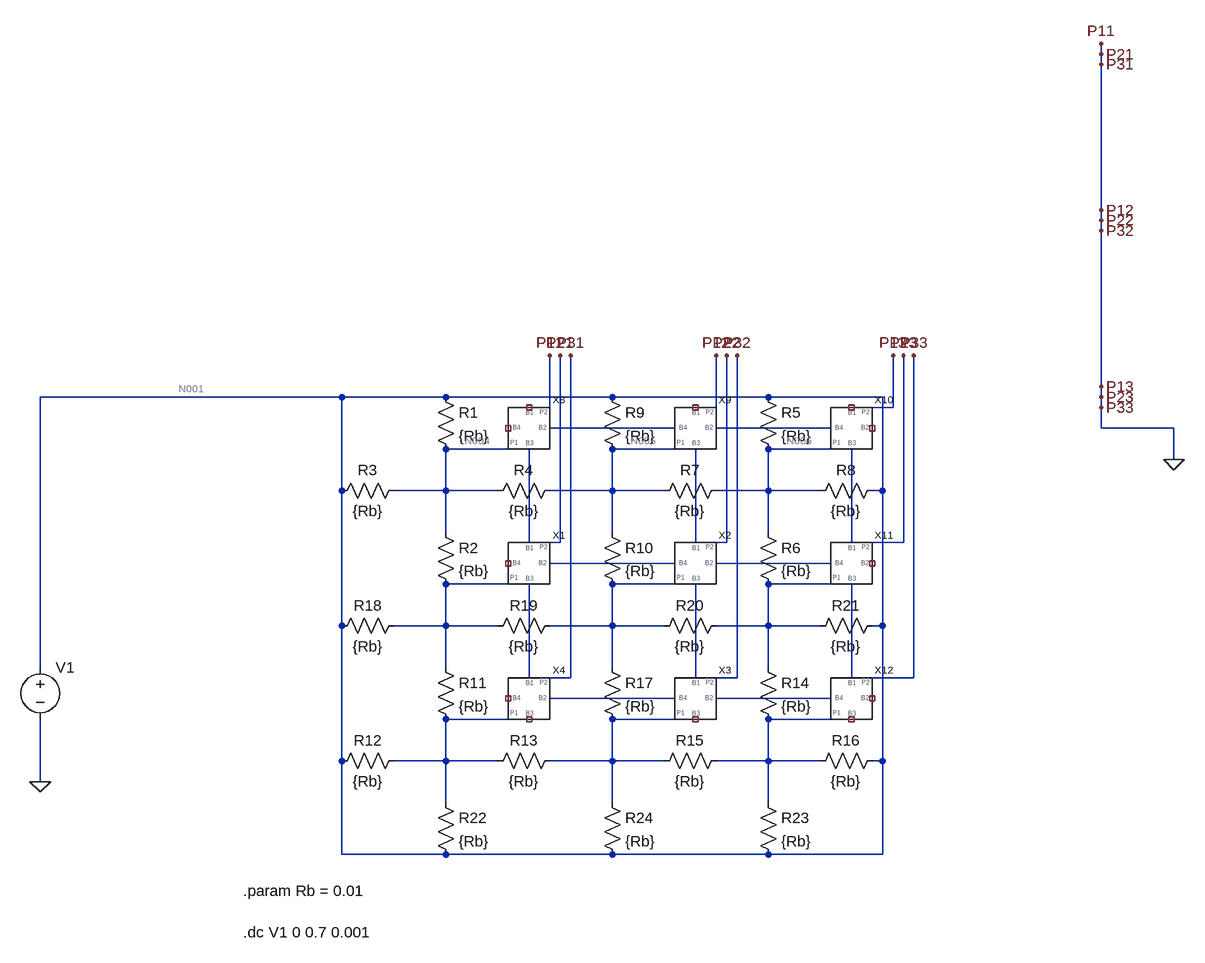
[diagram p0: schematic PV_Model.asc]
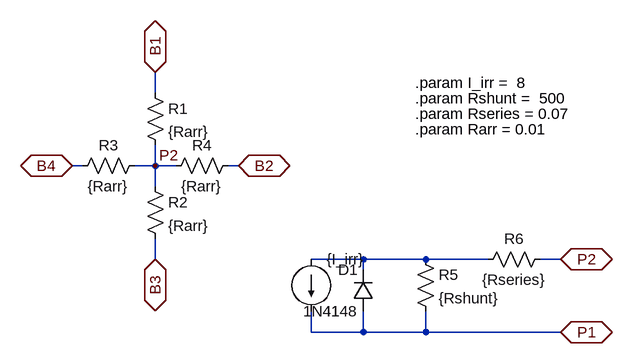
[diagram p1: sub-circuit pv_motif.asc]
PV_Model.asc, the LTspice schematic file:
Version 4
SHEET 1 1476 920
WIRE 1344 -448 1344 -464
WIRE 1344 -432 1344 -448
WIRE 1344 -208 1344 -432
WIRE 1344 -192 1344 -208
WIRE 1344 -176 1344 -192
WIRE 1344 64 1344 -176
WIRE 176 80 -288 80
WIRE 336 80 176 80
WIRE 592 80 336 80
WIRE 832 80 592 80
WIRE 1008 80 832 80
WIRE 1344 80 1344 64
WIRE 496 96 496 16
WIRE 752 96 752 16
WIRE 1024 96 1024 16
WIRE 1024 96 992 96
WIRE 1344 96 1344 80
WIRE 688 128 496 128
WIRE 928 128 752 128
WIRE 1344 128 1344 96
WIRE 1456 128 1344 128
WIRE 432 160 336 160
WIRE 688 160 592 160
WIRE 928 160 832 160
WIRE 1456 176 1456 128
WIRE 176 224 176 80
WIRE 336 224 336 160
WIRE 336 224 256 224
WIRE 416 224 336 224
WIRE 592 224 592 160
WIRE 592 224 496 224
WIRE 672 224 592 224
WIRE 832 224 832 160
WIRE 832 224 752 224
WIRE 912 224 832 224
WIRE 1008 224 1008 80
WIRE 1008 224 992 224
WIRE 336 288 336 224
WIRE 592 288 592 224
WIRE 832 288 832 224
WIRE 464 304 464 160
WIRE 512 304 512 16
WIRE 512 304 496 304
WIRE 720 304 720 160
WIRE 768 304 768 16
WIRE 768 304 752 304
WIRE 960 304 960 160
WIRE 1040 304 1040 16
WIRE 1040 304 992 304
WIRE 688 336 496 336
WIRE 928 336 752 336
WIRE 432 368 336 368
WIRE 688 368 592 368
WIRE 928 368 832 368
WIRE 176 432 176 224
WIRE 336 432 336 368
WIRE 336 432 256 432
WIRE 416 432 336 432
WIRE 592 432 592 368
WIRE 592 432 496 432
WIRE 672 432 592 432
WIRE 832 432 832 368
WIRE 832 432 752 432
WIRE 912 432 832 432
WIRE 1008 432 1008 224
WIRE 1008 432 992 432
WIRE -288 496 -288 80
WIRE 336 496 336 432
WIRE 592 496 592 432
WIRE 832 496 832 432
WIRE 464 512 464 368
WIRE 528 512 528 16
WIRE 528 512 496 512
WIRE 720 512 720 368
WIRE 784 512 784 16
WIRE 784 512 752 512
WIRE 960 512 960 368
WIRE 1056 512 1056 16
WIRE 1056 512 992 512
WIRE 688 544 496 544
WIRE 928 544 752 544
WIRE 432 576 336 576
WIRE 688 576 592 576
WIRE 928 576 832 576
WIRE 176 640 176 432
WIRE 336 640 336 576
WIRE 336 640 256 640
WIRE 416 640 336 640
WIRE 592 640 592 576
WIRE 592 640 496 640
WIRE 672 640 592 640
WIRE 832 640 832 576
WIRE 832 640 752 640
WIRE 912 640 832 640
WIRE 1008 640 1008 432
WIRE 1008 640 992 640
WIRE -288 672 -288 576
WIRE 336 704 336 640
WIRE 592 704 592 640
WIRE 832 704 832 640
WIRE 176 784 176 640
WIRE 336 784 176 784
WIRE 592 784 336 784
WIRE 832 784 592 784
WIRE 1008 784 1008 640
WIRE 1008 784 832 784
FLAG -288 672 0
FLAG 496 16 P11
FLAG 512 16 P21
FLAG 528 16 P31
FLAG 752 16 P12
FLAG 768 16 P22
FLAG 784 16 P32
FLAG 1024 16 P13
FLAG 1040 16 P23
FLAG 1056 16 P33
FLAG 1344 -464 P11
FLAG 1344 -448 P21
FLAG 1344 -432 P31
FLAG 1344 -208 P12
FLAG 1344 -192 P22
FLAG 1344 -176 P32
FLAG 1344 64 P13
FLAG 1344 80 P23
FLAG 1344 96 P33
FLAG 1456 176 0
SYMBOL res 320 64 R0
SYMATTR InstName R1
SYMATTR Value {Rb}
SYMBOL res 320 272 R0
SYMATTR InstName R2
SYMATTR Value {Rb}
SYMBOL res 272 208 R90
WINDOW 0 0 56 VBottom 2
WINDOW 3 32 56 VTop 2
SYMATTR InstName R3
SYMATTR Value {Rb}
SYMBOL res 816 64 R0
SYMATTR InstName R5
SYMATTR Value {Rb}
SYMBOL res 816 272 R0
SYMATTR InstName R6
SYMATTR Value {Rb}
SYMBOL res 768 208 R90
WINDOW 0 0 56 VBottom 2
WINDOW 3 32 56 VTop 2
SYMATTR InstName R7
SYMATTR Value {Rb}
SYMBOL res 1008 208 R90
WINDOW 0 0 56 VBottom 2
WINDOW 3 32 56 VTop 2
SYMATTR InstName R8
SYMATTR Value {Rb}
SYMBOL res 576 64 R0
SYMATTR InstName R9
SYMATTR Value {Rb}
SYMBOL res 576 272 R0
SYMATTR InstName R10
SYMATTR Value {Rb}
SYMBOL res 320 480 R0
SYMATTR InstName R11
SYMATTR Value {Rb}
SYMBOL res 272 624 R90
WINDOW 0 0 56 VBottom 2
WINDOW 3 32 56 VTop 2
SYMATTR InstName R12
SYMATTR Value {Rb}
SYMBOL res 512 624 R90
WINDOW 0 0 56 VBottom 2
WINDOW 3 32 56 VTop 2
SYMATTR InstName R13
SYMATTR Value {Rb}
SYMBOL res 816 480 R0
SYMATTR InstName R14
SYMATTR Value {Rb}
SYMBOL res 768 624 R90
WINDOW 0 0 56 VBottom 2
WINDOW 3 32 56 VTop 2
SYMATTR InstName R15
SYMATTR Value {Rb}
SYMBOL res 1008 624 R90
WINDOW 0 0 56 VBottom 2
WINDOW 3 32 56 VTop 2
SYMATTR InstName R16
SYMATTR Value {Rb}
SYMBOL res 576 480 R0
SYMATTR InstName R17
SYMATTR Value {Rb}
SYMBOL res 272 416 R90
WINDOW 0 0 56 VBottom 2
WINDOW 3 32 56 VTop 2
SYMATTR InstName R18
SYMATTR Value {Rb}
SYMBOL res 512 416 R90
WINDOW 0 0 56 VBottom 2
WINDOW 3 32 56 VTop 2
SYMATTR InstName R19
SYMATTR Value {Rb}
SYMBOL res 768 416 R90
WINDOW 0 0 56 VBottom 2
WINDOW 3 32 56 VTop 2
SYMATTR InstName R20
SYMATTR Value {Rb}
SYMBOL res 1008 416 R90
WINDOW 0 0 56 VBottom 2
WINDOW 3 32 56 VTop 2
SYMATTR InstName R21
SYMATTR Value {Rb}
SYMBOL res 320 688 R0
SYMATTR InstName R22
SYMATTR Value {Rb}
SYMBOL res 816 688 R0
SYMATTR InstName R23
SYMATTR Value {Rb}
SYMBOL res 576 688 R0
SYMATTR InstName R24
SYMATTR Value {Rb}
SYMBOL PV_Motif 464 336 R0
SYMATTR InstName X1
SYMBOL PV_Motif 720 336 R0
SYMATTR InstName X2
SYMBOL PV_Motif 720 544 R0
SYMATTR InstName X3
SYMBOL PV_Motif 464 544 R0
SYMATTR InstName X4
SYMBOL PV_Motif 464 128 R0
SYMATTR InstName X8
SYMBOL PV_Motif 720 128 R0
SYMATTR InstName X9
SYMBOL PV_Motif 960 128 R0
SYMATTR InstName X10
SYMBOL PV_Motif 960 336 R0
SYMATTR InstName X11
SYMBOL PV_Motif 960 544 R0
SYMATTR InstName X12
SYMBOL res 400 240 R270
WINDOW 0 32 56 VTop 2
WINDOW 3 0 56 VBottom 2
SYMATTR InstName R4
SYMATTR Value {Rb}
SYMBOL voltage -288 480 R0
WINDOW 123 0 0 Left 0
WINDOW 39 0 0 Left 0
SYMATTR InstName V1
SYMATTR Value ""
TEXT 24 904 Left 2 !.dc V1 0 0.7 0.001
TEXT 24 840 Left 2 !.param Rb = 0.01

pv_motif.asc, the sub-circuit schematic file:
Version 4
SHEET 1 2152 2064
WIRE -1936 400 -1936 368
WIRE -2048 512 -2064 512
WIRE -1936 512 -1936 480
WIRE -1936 512 -1968 512
WIRE -1904 512 -1936 512
WIRE -1808 512 -1824 512
WIRE -1936 544 -1936 512
WIRE -1936 656 -1936 624
WIRE -1616 656 -1696 656
WIRE -1520 656 -1616 656
WIRE -1424 656 -1520 656
WIRE -1312 656 -1344 656
WIRE -1616 672 -1616 656
WIRE -1696 768 -1696 736
WIRE -1616 768 -1616 736
WIRE -1616 768 -1696 768
WIRE -1520 768 -1520 736
WIRE -1520 768 -1616 768
WIRE -1312 768 -1520 768
FLAG -1936 368 B1
IOPIN -1936 368 BiDir
FLAG -1808 512 B2
IOPIN -1808 512 BiDir
FLAG -1936 656 B3
IOPIN -1936 656 BiDir
FLAG -2064 512 B4
IOPIN -2064 512 BiDir
FLAG -1312 768 P1
IOPIN -1312 768 BiDir
FLAG -1936 512 P2
FLAG -1312 656 P2
IOPIN -1312 656 BiDir
SYMBOL res -1952 384 R0
SYMATTR InstName R1
SYMATTR Value {Rarr}
SYMBOL res -1952 528 R0
SYMATTR InstName R2
SYMATTR Value {Rarr}
SYMBOL res -1952 496 R90
WINDOW 0 0 56 VBottom 2
WINDOW 3 32 56 VTop 2
SYMATTR InstName R3
SYMATTR Value {Rarr}
SYMBOL res -1808 496 R90
WINDOW 0 0 56 VBottom 2
WINDOW 3 32 56 VTop 2
SYMATTR InstName R4
SYMATTR Value {Rarr}
SYMBOL diode -1600 736 R180
WINDOW 0 24 64 Left 2
WINDOW 3 24 0 Left 2
SYMATTR InstName D1
SYMATTR Value 1N4148
SYMBOL current -1696 656 R0
WINDOW 0 24 80 Left 2
WINDOW 3 24 0 Left 2
WINDOW 123 0 0 Left 0
WINDOW 39 0 0 Left 0
SYMATTR InstName I1
SYMATTR Value {I_irr}
SYMBOL res -1536 640 R0
SYMATTR InstName R5
SYMATTR Value {Rshunt}
SYMBOL res -1328 640 R90
WINDOW 0 0 56 VBottom 2
WINDOW 3 32 56 VTop 2
SYMATTR InstName R6
SYMATTR Value {Rseries}
TEXT -1536 384 Left 2 !.param I_irr =  8
TEXT -1536 408 Left 2 !.param Rshunt =  500
TEXT -1536 432 Left 2 !.param Rseries = 0.07
TEXT -1536 456 Left 2 !.param Rarr = 0.01

The netlist it stands for:
* PV_Model.asc
R1 N001 N004 {Rb}
R2 N004 N012 {Rb}
R3 N004 N001 {Rb}
R5 N001 N006 {Rb}
R6 N006 N014 {Rb}
R7 N006 N005 {Rb}
R8 N001 N006 {Rb}
R9 N001 N005 {Rb}
R10 N005 N013 {Rb}
R11 N012 N020 {Rb}
R12 N020 N001 {Rb}
R13 N021 N020 {Rb}
R14 N014 N022 {Rb}
R15 N022 N021 {Rb}
R16 N001 N022 {Rb}
R17 N013 N021 {Rb}
R18 N012 N001 {Rb}
R19 N013 N012 {Rb}
R20 N014 N013 {Rb}
R21 N001 N014 {Rb}
R22 N020 N001 {Rb}
R23 N022 N001 {Rb}
R24 N021 N001 {Rb}
XX1 N007 N010 N015 NC_01 N012 0 pv_motif
XX2 N008 N011 N016 N010 N013 0 pv_motif
XX3 N016 N019 NC_02 N018 N021 0 pv_motif
XX4 N015 N018 NC_03 NC_04 N020 0 pv_motif
XX8 NC_05 N002 N007 NC_06 N004 0 pv_motif
XX9 NC_07 N003 N008 N002 N005 0 pv_motif
XX10 NC_08 NC_09 N009 N003 N006 0 pv_motif
XX11 N009 NC_10 N017 N011 N014 0 pv_motif
XX12 N017 NC_11 NC_12 N019 N022 0 pv_motif
R4 N004 N005 {Rb}
V1 N001 0

* block symbol definitions
.subckt pv_motif B1 B2 B3 B4 P1 P2
R1 B1 P2 {Rarr}
R2 P2 B3 {Rarr}
R3 P2 B4 {Rarr}
R4 B2 P2 {Rarr}
D1 P1 N001 1N4148
I1 N001 P1 {I_irr}
R5 N001 P1 {Rshunt}
R6 P2 N001 {Rseries}
.param I_irr =  8
.param Rshunt =  500
.param Rseries = 0.07
.param Rarr = 0.01
.ends pv_motif

.model D D
.lib standard.dio
.dc V1 0 0.7 0.001
.param Rb = 0.01
.backanno
.end

* Results of the author's LTspice run, read from the files saved beside the schematic
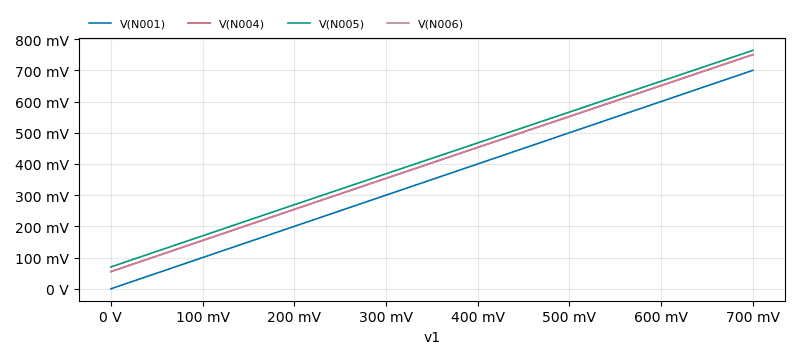
[diagram p2: DC transfer characteristic of PV_Model.asc, plotted from the saved traces]
* DC transfer characteristic, 1 run:
*   V(N001): 0 V at v1=0 V, 700 mV at v1=700 mV, min 0 V, max 700 mV
*   V(N004): 54.98 mV at v1=0 V, 750.3 mV at v1=700 mV, min 54.98 mV, max 750.3 mV
*   V(N005): 69.97 mV at v1=0 V, 763.9 mV at v1=700 mV, min 69.97 mV, max 763.9 mV
*   V(N006): 54.98 mV at v1=0 V, 750.3 mV at v1=700 mV, min 54.98 mV, max 750.3 mV